# Altium project Toygether_PCB_Project.PrjPCB
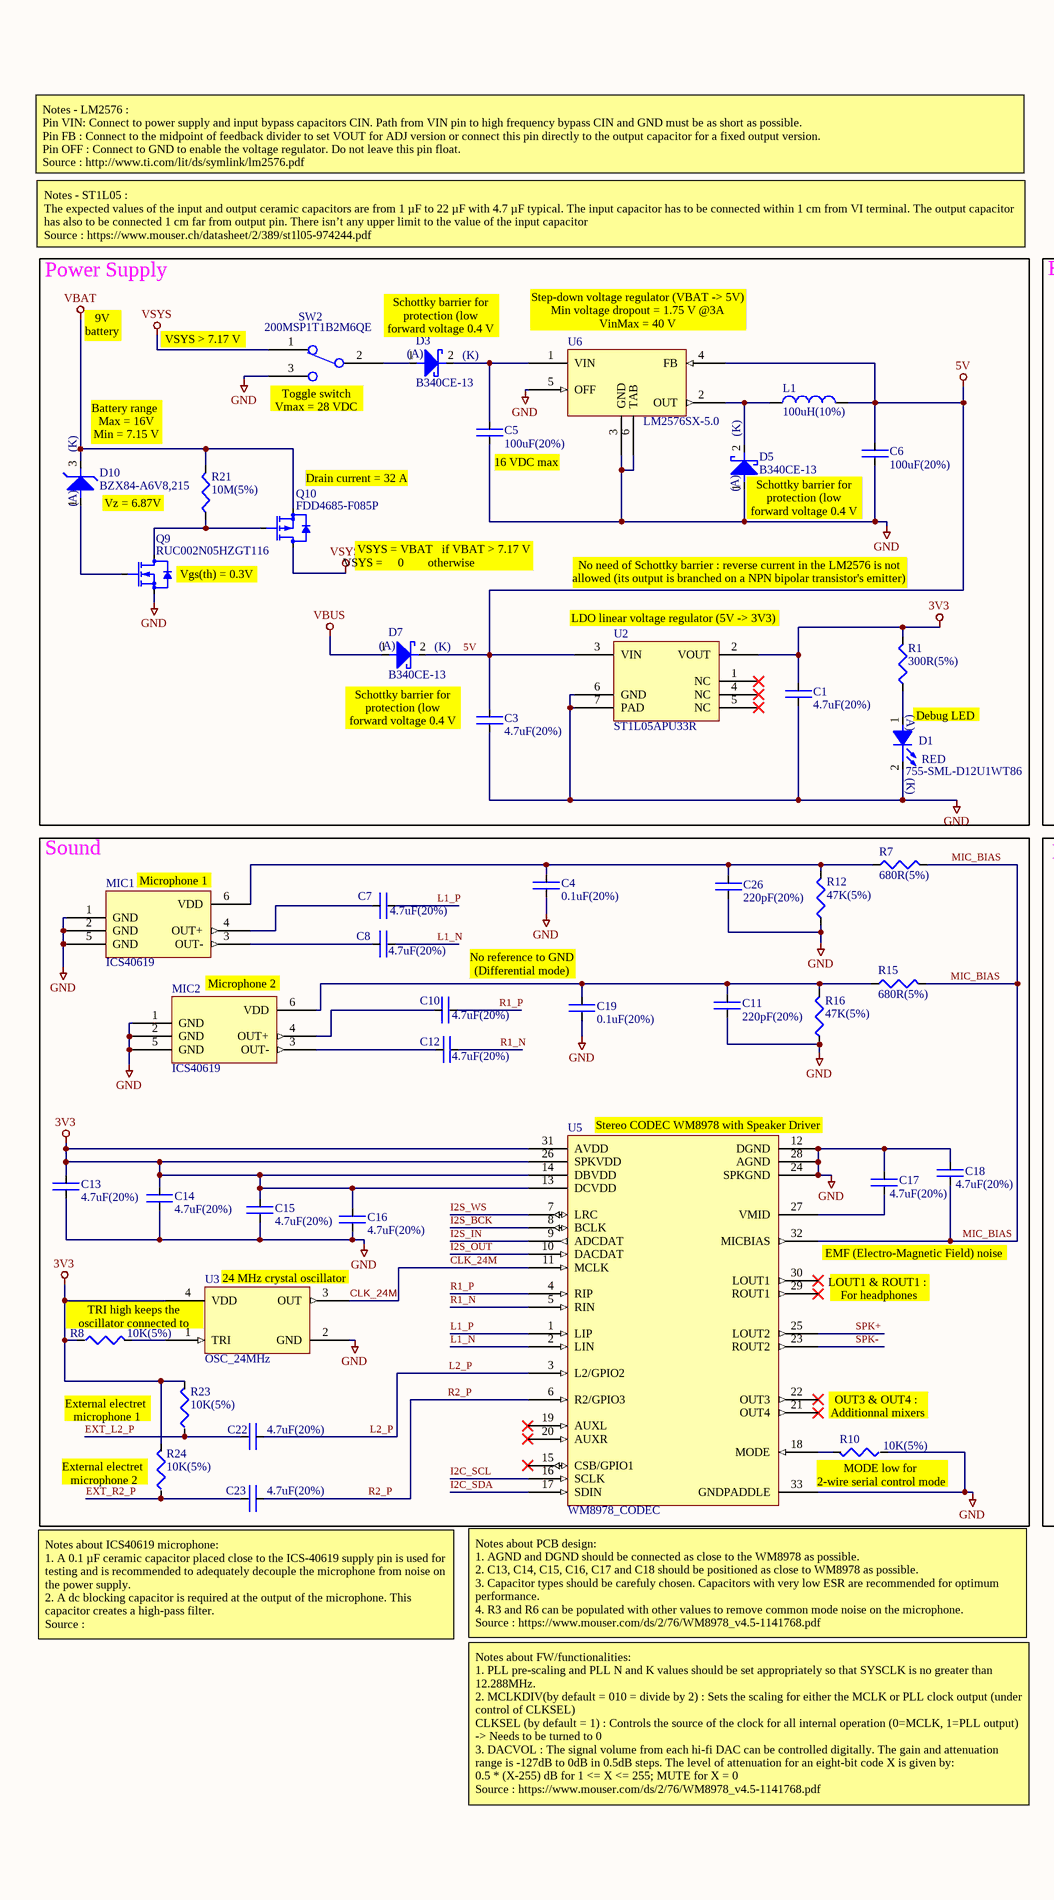
[diagram p0: Toygether_Sch.SchDoc, left]
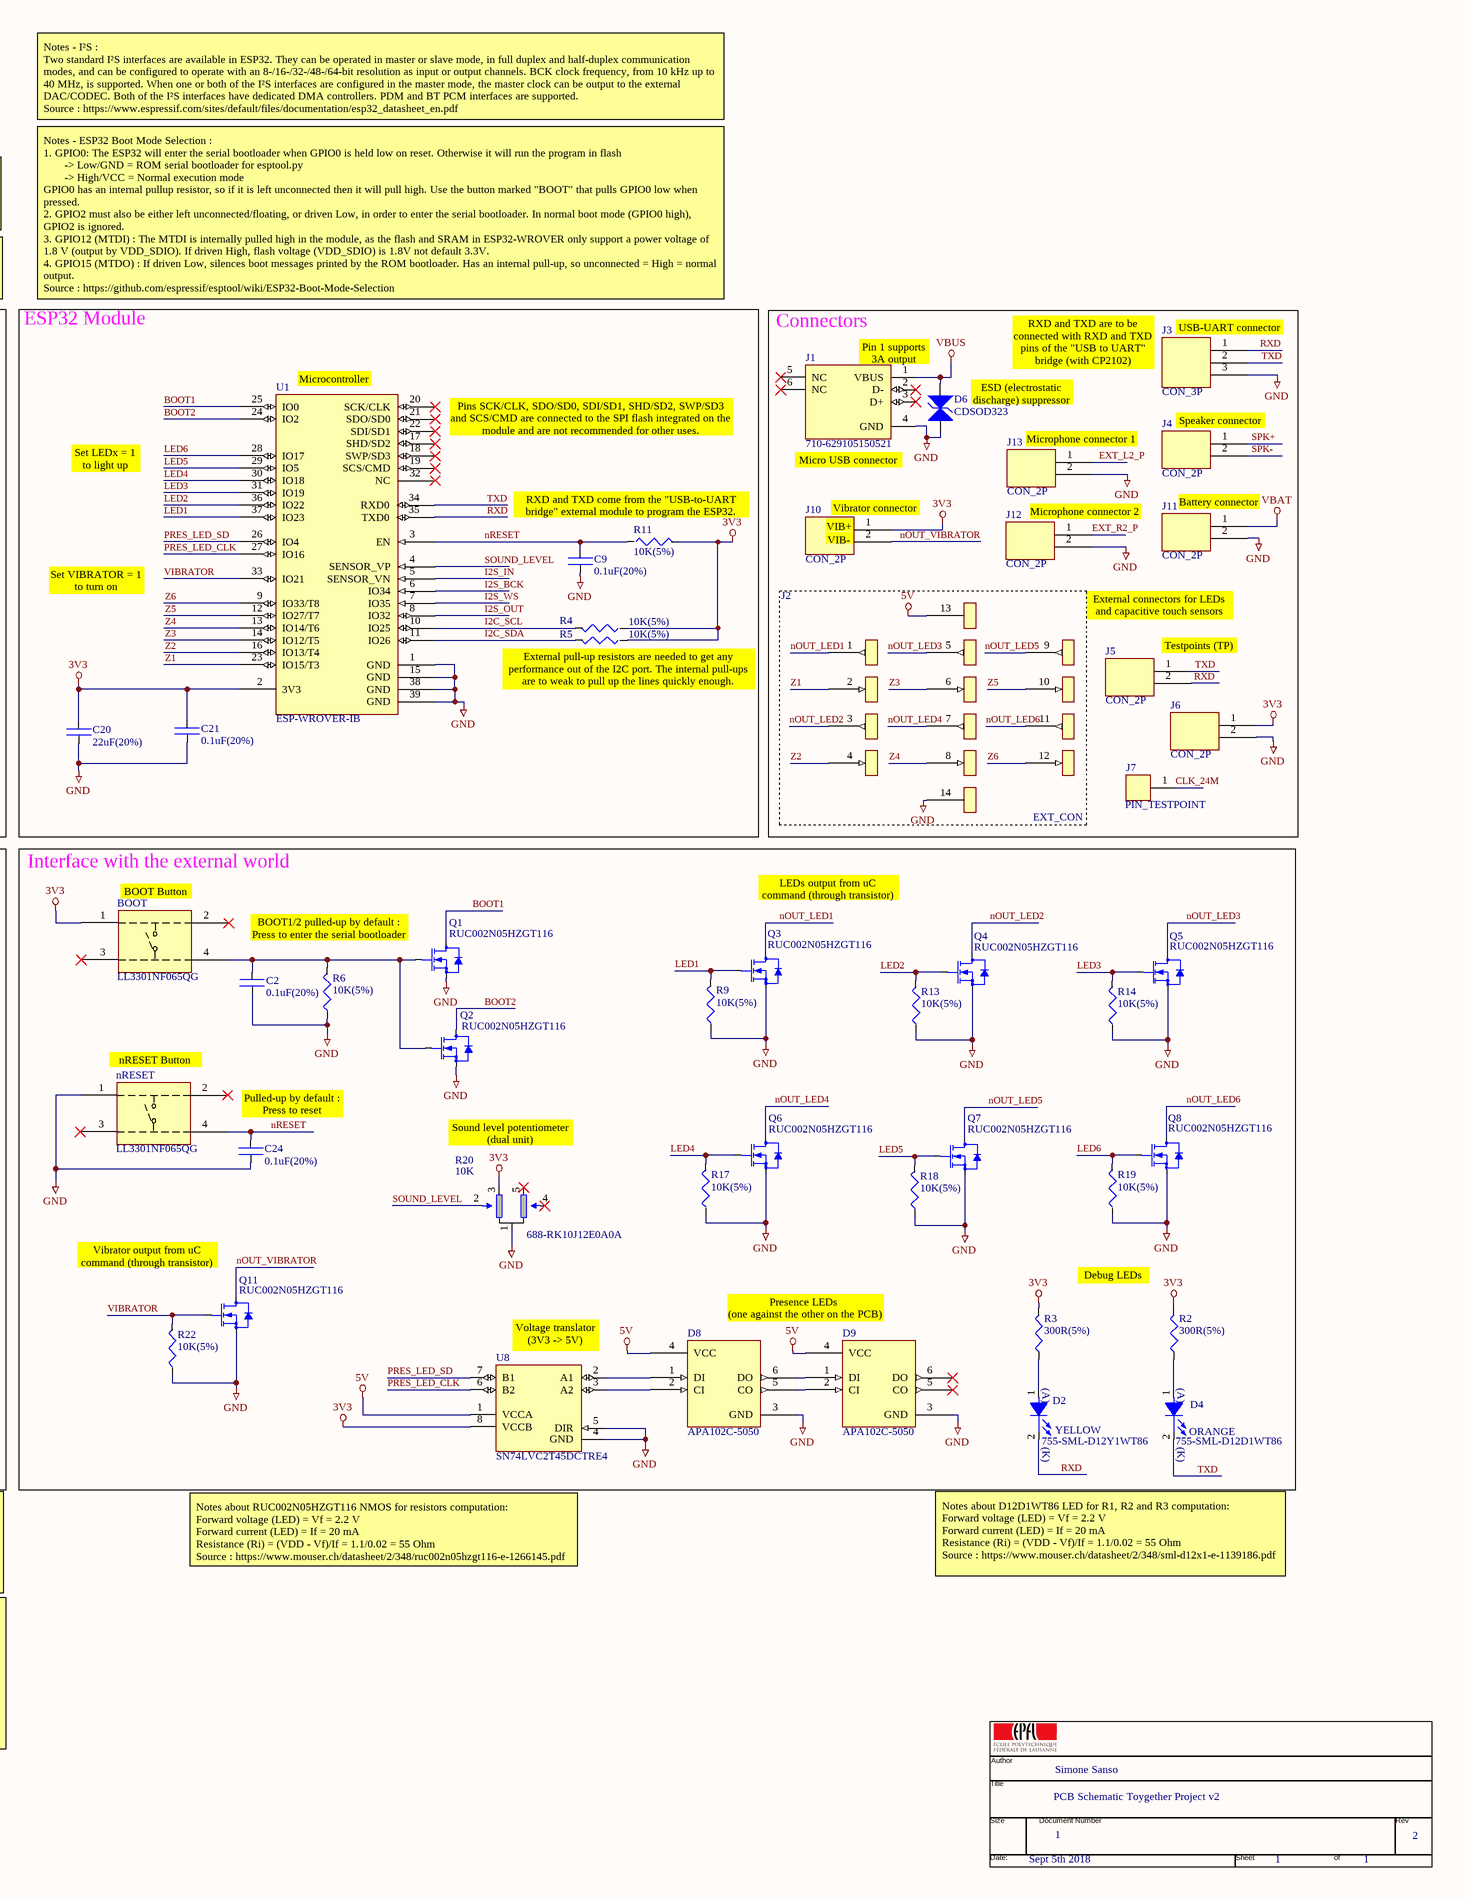
[diagram p1: Toygether_Sch.SchDoc, right]
1 sheet, 94 parts. Net scope: global (net labels, ports and power ports of the same name join across sheets).
Board file: Toygether_PCB.PcbDoc

## Sheet Toygether_Sch.SchDoc
size 513 x 386 mm

### Parts
BOOT  LL3301NF065QG  [PUSH_BUTTON-LL3301NF065QG]
C1  4.7uF(20%)  [CAPC0603]
C2  0.1uF(20%)  [CAPC0603]
C3  4.7uF(20%)  [CAPC0603]
C4  0.1uF(20%)  [CAPC0603]
C5  100uF(20%)  [CAPC2312]
C6  100uF(20%)  [CAPC2312]
C7  4.7uF(20%)  [CAPC0603]
C8  4.7uF(20%)  [CAPC0603]
C9  0.1uF(20%)  [CAPC0603]
C10  4.7uF(20%)  [CAPC0603]
C11  220pF(20%)  [CAPC0603]
C12  4.7uF(20%)  [CAPC0603]
C13  4.7uF(20%)  [CAPC0603]
C14  4.7uF(20%)  [CAPC0603]
C15  4.7uF(20%)  [CAPC0603]
C16  4.7uF(20%)  [CAPC0603]
C17  4.7uF(20%)  [CAPC0603]
C18  4.7uF(20%)  [CAPC0603]
C19  0.1uF(20%)  [CAPC0603]
C20  22uF(20%)  [CAPC0603]
C21  0.1uF(20%)  [CAPC0603]
C22  4.7uF(20%)  [CAPC0603]
C23  4.7uF(20%)  [CAPC0603]
C24  0.1uF(20%)  [CAPC0603]
C26  220pF(20%)  [CAPC0603]
D1  Supplier Part Number 1: 755-SML-D12U1WT86  [SML-D12U1WT86]  (hidden comment: SML-D12U1WT86)
D2  Supplier Part Number 1: 755-SML-D12Y1WT86  [SML-D12U1WT86]  (hidden comment: SML-D12Y1WT86)
D3  B340CE-13  [SCH_DIODE-B3xxCE]
D4  Supplier Part Number 1: 755-SML-D12D1WT86  [SML-D12U1WT86]  (hidden comment: SML-D12D1W)
D5  B340CE-13  [SCH_DIODE-B3xxCE]
D6  CDSOD323  [SOD-323-SCHOTTKY_DIODE-30V/0.5A]
D7  B340CE-13  [SCH_DIODE-B3xxCE]
D8  APA102C-5050  [APA102C-5050]
D9  APA102C-5050  [APA102C-5050]
D10  BZX84-A6V8,215  [ZEN_DIODE-SOT23]
J1  710-629105150521  [USB-MICRO-TYPE-B-FEM]
J2  EXT_CON  [EXT_CON_14P]
J3  CON_3P  [CON_3P]
J4  CON_2P  [CON_2P]
J5  CON_2P  [CON_2P]
J6  CON_2P  [CON_2P]
J7  PIN_TESTPOINT  [PIN_TESTPOINT]
J10  CON_2P  [CON_2P]
J11  CON_2P  [CON_2P]
J12  CON_2P  [CON_2P]
J13  CON_2P  [CON_2P]
L1  100uH(10%)  [IND1307-100uH]
MIC1  ICS40619  [MIC-ICS40619]
MIC2  ICS40619  [MIC-ICS40619]
nRESET  LL3301NF065QG  [PUSH_BUTTON-LL3301NF065QG]
Q1  RUC002N05HZGT116  [MOS-N_RUC002N05]
Q2  RUC002N05HZGT116  [MOS-N_RUC002N05]
Q3  RUC002N05HZGT116  [MOS-N_RUC002N05]
Q4  RUC002N05HZGT116  [MOS-N_RUC002N05]
Q5  RUC002N05HZGT116  [MOS-N_RUC002N05]
Q6  RUC002N05HZGT116  [MOS-N_RUC002N05]
Q7  RUC002N05HZGT116  [MOS-N_RUC002N05]
Q8  RUC002N05HZGT116  [MOS-N_RUC002N05]
Q9  RUC002N05HZGT116  [MOS-N_RUC002N05]
Q10  FDD4685-F085P  [MOS-P_FDD4685]
Q11  RUC002N05HZGT116  [MOS-N_RUC002N05]
R1  300R(5%)  [RC0603]
R2  300R(5%)  [RC0603]
R3  300R(5%)  [RC0603]
R4  10K(5%)  [RC0603]
R5  10K(5%)  [RC0603]
R6  10K(5%)  [RC0603]
R7  680R(5%)  [RC0603]
R8  10K(5%)  [RC0603]
R9  10K(5%)  [RC0603]
R10  10K(5%)  [RC0603]
R11  10K(5%)  [RC0603]
R12  47K(5%)  [RC0603]
R13  10K(5%)  [RC0603]
R14  10K(5%)  [RC0603]
R15  680R(5%)  [RC0603]
R16  47K(5%)  [RC0603]
R17  10K(5%)  [RC0603]
R18  10K(5%)  [RC0603]
R19  10K(5%)  [RC0603]
R20  10K  Supplier Part Number 1: 688-RK10J12E0A0A  [POT-RK10J12E0A0A]
R21  10M(5%)  [RC0603]
R22  10K(5%)  [RC0603]
R23  10K(5%)  [RC0603]
R24  10K(5%)  [RC0603]
SW2  200MSP1T1B2M6QE  [SPDT- 200MSP1T1B2M6QE]
T  TITLE_BLOCK  (value not drawn)
U1  ESP-WROVER-IB  [ESP32-WROVER-I]
U2  ST1L05APU33R  [LDO-ST1L05]
U3  OSC_24MHz  [OSC_24MHz]
U5  WM8978_CODEC  [WM8978_CODEC]
U6  LM2576SX-5.0  [LM2576SX-STEP_DOWN-5.0]
U8  SN74LVC2T45DCTRE4  [VOLTAGE_TRANSLATOR_3.3-5V]

### Blocks framed on the sheet
Power Supply: C1 C3 C5 C6 D1 D3 D5 D7 D10 L1 Q9 Q10 R1 R21 SW2 U2 U6
ESP32 Module: C9 C20 C21 R4 R5 R11 U1
Connectors: D6 J1-J7 J10-J13
Sound: C4 C7 C8 C10-C19 C22 C23 C26 MIC1 MIC2 R7 R8 R10 R12 R15 R16 R23 R24 U3 U5
Interface with the external world: BOOT C2 C24 D2 D4 D8 D9 nRESET Q1-Q8 Q11 R2 R3 R6 R9 R13 R14 R17-R20 R22 U8

### Nets
3V3: BOOT.1 C1.2 C13.2 C14.2 C15.2 C16.2 C20.2 C21.2 J6.1 J10.1 R1.2 R2.2 R3.2 R4.1 R5.1 R8.1 R11.2 R20.3 R23.2 R24.2 U1.2(3V3) U2.2(VOUT) U3.4(VDD) U5.13(DCVDD) U5.14(DBVDD) U5.26(SPKVDD) U5.31(AVDD) U8.8(VCCB)
5V: C3.2 C6.2 D7.2(K) D8.4(VCC) D9.4(VCC) J2.13 L1.2 U2.3(VIN) U6.4(FB) U8.1(VCCA)
GND: C1.1 C2.1 C3.1 C4.1 C5.1 C6.1 C9.1 C11.1 C13.1 C14.1 C15.1 C16.1 C17.2 C18.2 C19.1 C20.1 C21.1 C24.1 C26.1 D1.2 D5.1(A) D6.1(C) D8.3(GND) D9.3(GND) J1.4(GND) J2.14 J3.3 J6.2 J11.2 J12.2 J13.2 MIC1.1(GND) MIC1.2(GND) MIC1.5(GND) MIC2.1(GND) MIC2.2(GND) MIC2.5(GND) nRESET.1 Q1.2 Q2.2 Q3.2 Q4.2 Q5.2 Q6.2 Q7.2 Q8.2 Q9.2 Q11.2 R6.1 R9.1 R10.1 R12.1 R13.1 R14.1 R16.1 R17.1 R18.1 R19.1 R20.1 R22.1 SW2.3 U1.1(GND) U1.15(GND) U1.38(GND) U1.39(GND) U2.6(GND) U2.7(PAD) U3.2(GND) U5.12(DGND) U5.24(SPKGND) U5.28(AGND) U5.33(GNDPADDLE) U6.3(GND) U6.5(OFF) U6.6(TAB) U8.4(GND) U8.5(DIR)
VBAT: D10.3(K) J11.1 Q10.2 R21.2
VBUS: D6.2(C) D7.1(A) J1.1(VBUS)
VSYS: Q10.3 SW2.1
BOOT1: Q1.3 U1.25(IO0)
BOOT2: Q2.3 U1.24(IO2)
CLK_24M: J7.1(Testpoint) U3.3(OUT) U5.11(MCLK)
EXT_L2_P: C22.1 J13.1 R23.1
EXT_R2_P: C23.1 J12.1 R24.1
I2C_SCL: R4.2 U1.10(IO25) U5.16(SCLK)
I2C_SDA: R5.2 U1.11(IO26) U5.17(SDIN)
I2S_BCK: U1.6(IO34) U5.8(BCLK)
I2S_IN: U1.5(SENSOR_VN) U5.9(ADCDAT)
I2S_OUT: U1.8(IO32) U5.10(DACDAT)
I2S_WS: U1.7(IO35) U5.7(LRC)
L1_N: C8.1 U5.2(LIN)
L1_P: C7.1 U5.1(LIP)
L2_P: C22.2 U5.3(L2/GPIO2)
LED1: Q3.1 R9.2 U1.37(IO23)
LED2: Q4.1 R13.2 U1.36(IO22)
LED3: Q5.1 R14.2 U1.31(IO19)
LED4: Q6.1 R17.2 U1.30(IO18)
LED5: Q7.1 R18.2 U1.29(IO5)
LED6: Q8.1 R19.2 U1.28(IO17)
MIC_BIAS: C18.1 R7.2 R15.2 U5.32(MICBIAS)
nOUT_LED1: J2.1 Q3.3
nOUT_LED2: J2.3 Q4.3
nOUT_LED3: J2.5 Q5.3
nOUT_LED4: J2.7 Q6.3
nOUT_LED5: J2.9 Q7.3
nOUT_LED6: J2.11 Q8.3
nOUT_VIBRATOR: J10.2 Q11.3
nRESET: C9.2 C24.2 nRESET.4 R11.1 U1.3(EN)
PRES_LED_CLK: U1.27(IO16) U8.6(B2)
PRES_LED_SD: U1.26(IO4) U8.7(B1)
R1_N: C12.1 U5.5(RIN)
R1_P: C10.1 U5.4(RIP)
R2_P: C23.2 U5.6(R2/GPIO3)
RXD: D2.2 J3.1 J5.2 U1.35(TXD0)
SOUND_LEVEL: R20.2 U1.4(SENSOR_VP)
SPK+: J4.1 U5.25(LOUT2)
SPK-: J4.2 U5.23(ROUT2)
TXD: D4.2 J3.2 J5.1 U1.34(RXD0)
VIBRATOR: Q11.1 R22.2 U1.33(IO21)
Z1: J2.2 U1.23(IO15/T3)
Z2: J2.4 U1.16(IO13/T4)
Z3: J2.6 U1.14(IO12/T5)
Z4: J2.8 U1.13(IO14/T6)
Z5: J2.10 U1.12(IO27/T7)
Z6: J2.12 U1.9(IO33/T8)
NetBOOT_4: BOOT.4 C2.2 Q1.1 Q2.1 R6.2
NetC4_2: C4.2 C26.2 MIC1.6(VDD) R7.1 R12.2
NetC5_2: C5.2 D3.2(K) U6.1(VIN)
NetC7_2: C7.2 MIC1.4(OUT+)
NetC8_2: C8.2 MIC1.3(OUT-)
NetC10_2: C10.2 MIC2.4(OUT+)
NetC11_2: C11.2 C19.2 MIC2.6(VDD) R15.1 R16.2
NetC12_2: C12.2 MIC2.3(OUT-)
NetC17_1: C17.1 U5.27(VMID)
NetD1_1: D1.1 R1.1
NetD2_1: D2.1 R3.1
NetD3_1: D3.1(A) SW2.2
NetD4_1: D4.1 R2.1
NetD5_2: D5.2(K) L1.1 U6.2(OUT)
NetD8_1: D8.1(DI) U8.2(A1)
NetD8_2: D8.2(CI) U8.3(A2)
NetD8_5: D8.5(CO) D9.2(CI)
NetD8_6: D8.6(DO) D9.1(DI)
NetD10_1: D10.1(A) Q9.1
NetQ9_3: Q9.3 Q10.1 R21.1
NetR8_2: R8.2 U3.1(TRI)
NetR10_2: R10.2 U5.18(MODE)

Not connected (* = marked no-connect by the designer): BOOT 2* 3*; D9 5(CO)* 6(DO)*; J1 2(D-)* 3(D+)* 5(NC)* 6(NC)*; nRESET 2* 3*; R20 4* 5*; U1 17(SHD/SD2)* 18(SWP/SD3)* 19(SCS/CMD)* 20(SCK/CLK)* 21(SDO/SD0)* 22(SDI/SD1)* 32(NC)*; U2 1(NC)* 4(NC)* 5(NC)*; U5 15(CSB/GPIO1)* 19(AUXL)* 20(AUXR)* 21(OUT4)* 22(OUT3)* 29(ROUT1)* 30(LOUT1)*

### Notes on the sheet
- Notes - I²S :
  Two standard I²S interfaces are available in ESP32. They can be operated in master or slave mode, in full duplex and half-duplex communication modes, and can be configured to operate with an 8-/16-/32-/48-/64-bit resolution as input or output channels. BCK clock frequency, from 10 kHz up to 40 MHz, is supported. When one or both of the I²S interfaces are configured in the master mode, the master clock can be output to the external
  DAC/CODEC. Both of the I²S interfaces have dedicated DMA controllers. PDM and BT PCM interfaces are supported.
  Source : https://www.espressif.com/sites/default/files/documentation/esp32_datasheet_en.pdf
- Notes - LM2576 :
  Pin VIN: Connect to power supply and input bypass capacitors CIN. Path from VIN pin to high frequency bypass CIN and GND must be as short as possible.
  Pin FB : Connect to the midpoint of feedback divider to set VOUT for ADJ version or connect this pin directly to the output capacitor for a fixed output version.
  Pin OFF : Connect to GND to enable the voltage regulator. Do not leave this pin float.
  Source : http://www.ti.com/lit/ds/symlink/lm2576.pdf
- Notes - ST1L05 :
  The expected values of the input and output ceramic capacitors are from 1 µF to 22 µF with 4.7 µF typical. The input capacitor has to be connected within 1 cm from VI terminal. The output capacitor has also to be connected 1 cm far from output pin. There isn’t any upper limit to the value of the input capacitor
  Source : https://www.mouser.ch/datasheet/2/389/st1l05-974244.pdf
- Notes - ESP32 Boot Mode Selection :
  1. GPIO0: The ESP32 will enter the serial bootloader when GPIO0 is held low on reset. Otherwise it will run the program in flash
  -> Low/GND = ROM serial bootloader for esptool.py
  -> High/VCC = Normal execution mode
  GPIO0 has an internal pullup resistor, so if it is left unconnected then it will pull high. Use the button marked "BOOT" that pulls GPIO0 low when pressed.
  2. GPIO2 must also be either left unconnected/floating, or driven Low, in order to enter the serial bootloader. In normal boot mode (GPIO0 high), GPIO2 is ignored.
  3. GPIO12 (MTDI) : The MTDI is internally pulled high in the module, as the flash and SRAM in ESP32-WROVER only support a power voltage of 1.8 V (output by VDD_SDIO). If driven High, flash voltage (VDD_SDIO) is 1.8V not default 3.3V.
  4. GPIO15 (MTDO) : If driven Low, silences boot messages printed by the ROM bootloader. Has an internal pull-up, so unconnected = High = normal output.
  Source : https://github.com/espressif/esptool/wiki/ESP32-Boot-Mode-Selection
- (near J1) Pin 1 supports 3A output current
- RXD and TXD are to be connected with RXD and TXD pins of the "USB to UART" bridge (with CP2102)
- (near J3) USB-UART connector
- 9V battery
- VSYS > 7.17 V
- Schottky barrier for protection (low forward voltage 0.4 V @ 3A)
- (near U6) Step-down voltage regulator (VBAT -> 5V)
  Min voltage dropout = 1.75 V @3A
  VinMax = 40 V
- (near U1) Microcontroller
- Pins SCK/CLK, SDO/SD0, SDI/SD1, SHD/SD2, SWP/SD3 and SCS/CMD are connected to the SPI flash integrated on the module and are not recommended for other uses.
- (near D6) ESD (electrostatic discharge) suppressor
- (near J4) Speaker connector
- (near D10) Battery range
  Max = 16V
  Min = 7.15 V
- (near SW2) Toggle switch
  Vmax = 28 VDC
- Set LEDx = 1 to light up
- (near J1) Micro USB connector
- (near J13) Microphone connector 1
- (near D10) Vz = 6.87V
- (near Q10) Drain current = 32 A
- (near C5) 16 VDC max
- (near D5) Schottky barrier for protection (low forward voltage 0.4 V @ 3A)
- RXD and TXD come from the "USB-to-UART bridge" external module to program the ESP32.
- (near J10) VIB+
- (near J10) VIB-
- (near J10) Vibrator connector
- (near J12) Microphone connector 2
- (near J11) Battery connector
- Vgs(th) = 0.3V
- VSYS = VBAT   if VBAT > 7.17 V
  VSYS =     0        otherwise
- No need of Schottky barrier : reverse current in the LM2576 is not allowed (its output is branched on a NPN bipolar transistor's emitter)
- Set VIBRATOR = 1 to turn on
- (near J2) External connectors for LEDs and capacitive touch sensors
- (near U2) LDO linear voltage regulator (5V -> 3V3)
- (near J5) Testpoints (TP)
- (near D1) Debug LED
- (near R5) External pull-up resistors are needed to get any performance out of the I2C port. The internal pull-ups are to weak to pull up the lines quickly enough.
- (near D1) RED
- (near MIC1) Microphone 1
- (near BOOT) BOOT Button
- LEDs output from uC command (through transistor)
- No reference to GND
  (Differential mode)
- (near Q1) BOOT1/2 pulled-up by default : Press to enter the serial bootloader
- Microphone 2
- (near nRESET) nRESET Button
- (near U5) Stereo CODEC WM8978 with Speaker Driver
- (near C24) Pulled-up by default : Press to reset
- Sound level potentiometer (dual unit)
- (near U3) 24 MHz crystal oscillator
- EMF (Electro-Magnetic Field) noise
- (near U5) LOUT1 & ROUT1 :
  For headphones
- (near Q11) Vibrator output from uC command (through transistor)
- Debug LEDs
- (near U3) TRI high keeps the oscillator connected to OUT
- (near U8) Voltage translator (3V3 -> 5V)
- Presence LEDs
  (one against the other on the PCB)
- External electret
  microphone 1
- OUT3 & OUT4 :
  Additionnal mixers
- (near R24) External electret
  microphone 2
- (near R10) MODE low for
  2-wire serial control mode
- (near D2) YELLOW
- (near D4) ORANGE
- Notes about ICS40619 microphone:
  1. A 0.1 µF ceramic capacitor placed close to the ICS‐40619 supply pin is used for testing and is recommended to adequately decouple the microphone from noise on the power supply.
  2. A dc blocking capacitor is required at the output of the microphone. This capacitor creates a high‐pass filter.
  Source : https://eu.mouser.com/datasheet/2/400/ICS-40619-Datasheet-1113071.pdf
- (near U5) Notes about PCB design:
  1. AGND and DGND should be connected as close to the WM8978 as possible.
  2. C13, C14, C15, C16, C17 and C18 should be positioned as close to WM8978 as possible.
  3. Capacitor types should be carefuly chosen. Capacitors with very low ESR are recommended for optimum performance.
  4. R3 and R6 can be populated with other values to remove common mode noise on the microphone.
  Source : https://www.mouser.com/ds/2/76/WM8978_v4.5-1141768.pdf
- Notes about RUC002N05HZGT116 NMOS for resistors computation:
  Forward voltage (LED) = Vf = 2.2 V
  Forward current (LED) = If = 20 mA
  Resistance (Ri) = (VDD - Vf)/If = 1.1/0.02 = 55 Ohm
  Source : https://www.mouser.ch/datasheet/2/348/ruc002n05hzgt116-e-1266145.pdf
- Notes about D12D1WT86 LED for R1, R2 and R3 computation:
  Forward voltage (LED) = Vf = 2.2 V
  Forward current (LED) = If = 20 mA
  Resistance (Ri) = (VDD - Vf)/If = 1.1/0.02 = 55 Ohm
  Source : https://www.mouser.ch/datasheet/2/348/sml-d12x1-e-1139186.pdf
- Notes about FW/functionalities:
  1. PLL pre-scaling and PLL N and K values should be set appropriately so that SYSCLK is no greater than 12.288MHz.
  2. MCLKDIV(by default = 010 = divide by 2) : Sets the scaling for either the MCLK or PLL clock output (under control of CLKSEL)
  CLKSEL (by default = 1) : Controls the source of the clock for all internal operation (0=MCLK, 1=PLL output) -> Needs to be turned to 0
  3. DACVOL : The signal volume from each hi-fi DAC can be controlled digitally. The gain and attenuation range is -127dB to 0dB in 0.5dB steps. The level of attenuation for an eight-bit code X is given by:
  0.5 * (X-255) dB for 1 <= X <= 255; MUTE for X = 0
  Source : https://www.mouser.com/ds/2/76/WM8978_v4.5-1141768.pdf
- (in symbol ORANGE_LED) (A); (K)
- (in symbol RED_LED) (A); (K)
- (in symbol SCH_DIODE) (K); (A)
- (in symbol TITLE_BLOCK) Author; Simone Sanso; Title; PCB Schematic Toygether Project v2; Size; Document Number; Rev; 1; 2; Date:; Sheet; of; Sept 5th 2018
- (in symbol YELLOW_LED) (A); (K)
- (in symbol ZEN_DIODE-6.15V) (K); (A)

### Library data of the parts
BOOT nRESET = SPST_SW: Supplier 1: Mouser; Supplier Part Number 1: 612-LL3301NF065QG
C1 C3 C7 C8 C10 C12-C18 C22 C23 = CAP-4.7uF(20%): C1608JB1V475M080AC; Supplier 1: Mouser; Supplier Part Number 1: 810-C1608JB1V475M08C
C2 C4 C9 C19 C21 C24 = CAP-0.1uF(20%): C1608X8R1E104M080AA; Supplier 1: Mouser; Supplier Part Number 1: 810-C1608X8R1E104M0A
C5 C6 = CAP-100uF(20%): GRM31CR61A107ME05L; Supplier 1: Mouser; Supplier Part Number 1: 581-TPSF107M016R0200
C11 C26 = CAP-220pF(20%): C1608CH2A221J080AA; Supplier 1: Mouser; Supplier Part Number 1: 810-C1608CH2A221J08A
C20 = CAP-22uF(20%): F380J226MMAAH1; Supplier 1: Mouser; Supplier Part Number 1: 581-F380J226MMAAH1
D1 = RED_LED: SML-D12U1WT86-2.2V-20mA; Supplier 1: Mouser
D2 = YELLOW_LED: SML-D12Y1WT86_YELLOW-LED; Supplier 1: Mouser
D3 D5 D7 = SCH_DIODE: Supplier 1: Mouser; Supplier Part Number 1: 621-B340CE-13
D4 = ORANGE_LED: SML-D12D1WT86_ORANGE-LED; Supplier 1: Mouser
D6 = BIDIRECTIONAL_DIODE: CDSOD323-T05LC - ESD Suppressors / TVS Diodes Bidirectional Ultra Low Cap; Supplier 1: Mouser; Supplier Part Number 1: 652-CDSOD323-T05LC
D8 D9 = APA102C: Supplier 1: Mouser; Supplier Part Number 1: 474-COM-14863
D10 = ZEN_DIODE-6.15V: Supplier 1: Mouser; Supplier Part Number 1: 771-BZX84-A6V8,215
J1 = USB-MICRO-TYPE-B_CON_6P: USB Micro SMT Type B Horizontal; Supplier 1: Mouser; Supplier Part Number 1: 710-629105150521
J2 = EXT_CON: External connector to the LEDs and capacitive touch sensors (on the plush toy)
J3 = CON_3P: 3 Positions Header, Breakaway Connector 0.100" (2.54mm) Through Hole Tin
J4-J6 J10-J13 = CON_2P: 2 Positions Header, Breakaway Connector 0.100" (2.54mm) Through Hole Tin
J7 = PIN_TESTPOINT: 1 Position Header, Breakaway Connector 0.100" (2.54mm) Through Hole Tin
L1 = IND-100uH(10%): SDR1307A-101K; Supplier 1: Mouser; Supplier Part Number 1: 652-SDR1307A-101K
MIC1 MIC2 = MIC-ICS40619: Differential analog top-port microphone; Supplier 1: Mouser; Supplier Part Number 1: 410-ICS-40619
Q1-Q9 Q11 = MOSFET_N-CH_RUC002N05HZGT116: RUC002N05HZGT116 (N-CH/50V/2.2R/200mA); Supplier 1: Mouser; Supplier Part Number 1: 755-RUC002N05HZGT116
Q10 = MOSFET_P-CH_FDD4685-F085P: FDD4685-F085P(P-CH/40V/35mR/32A); Supplier 1: Mouser; Supplier Part Number 1: 512-FDD4685_F085P
R1-R3 = RES-300R(5%): RC0603JR-07300RL; Supplier 1: Mouser; Supplier Part Number 1: 603-RC0603JR-07300RL
R4-R6 R8-R11 R13 R14 R17-R19 R22-R24 = RES-10K(5%): RC0603JR-0710KL; Supplier 1: Mouser; Supplier Part Number 1: 603-RC0603JR-0710KL
R7 R15 = RES-680R(5%): RC0603JR-07680RL; Supplier 1: Mouser; Supplier Part Number 1: 603-RC0603JR-07680RL
R12 R16 = RES-47K(5%): RC0603JR-0747KL; Supplier 1: Mouser; Supplier Part Number 1: 603-RC0603JR-0747KL
R20 = POT-10K: RK10J12E0A0A; Supplier 1: Mouser
R21 = RES-10M(5%): CRCW060310M0DHEAP; Supplier 1: Mouser; Supplier Part Number 1: 71-CRCW060310M0DHEAP
SW2 = SPDT_SW: Supplier 1: Mouser; Supplier Part Number 1: 612-200MSP1T1B2M6QE
U2 = LDO-3.3: Low drop linear voltage regulator; Supplier 1: Mouser; Supplier Part Number 1: 511-ST1L05APU33R
U3 = OSC_24MHz: Crystal Oscillator for CODEC; Supplier 1: Mouser; Supplier Part Number 1: 520-3225MV-240-BNT
U5 = WM8978_CODEC: Stereo CODEC WM8978 with Speaker Driver; Supplier 1: Mouser; Supplier Part Number 1: 238-WM8978CGEFL/V
U6 = STEP_DOWN_LM2576SX-5.0: LM2576SX-5.0/NOPB step down voltage regulator; Supplier 1: Mouser; Supplier Part Number 1: 926-LM2576SX-5.0NOPB
U8 = VOLTAGE_TRANSLATOR_3.3-5V: Translation - Voltage Levels DUAL-BIT DUAL SUPPLY TRANSCEIVER; Supplier 1: Mouser; Supplier Part Number 1: 595-SN74LVC2T45DCTR
U1 = ESP-WROVER-IB: Supplier 1: Mouser; Supplier Part Number 1: 356-ESP32WROIB(16MB)